# Altium schematic sheet PowerSupp.SchDoc
size A3; DocumentNumber: 4; SheetNumber: 4; SheetTotal: 7
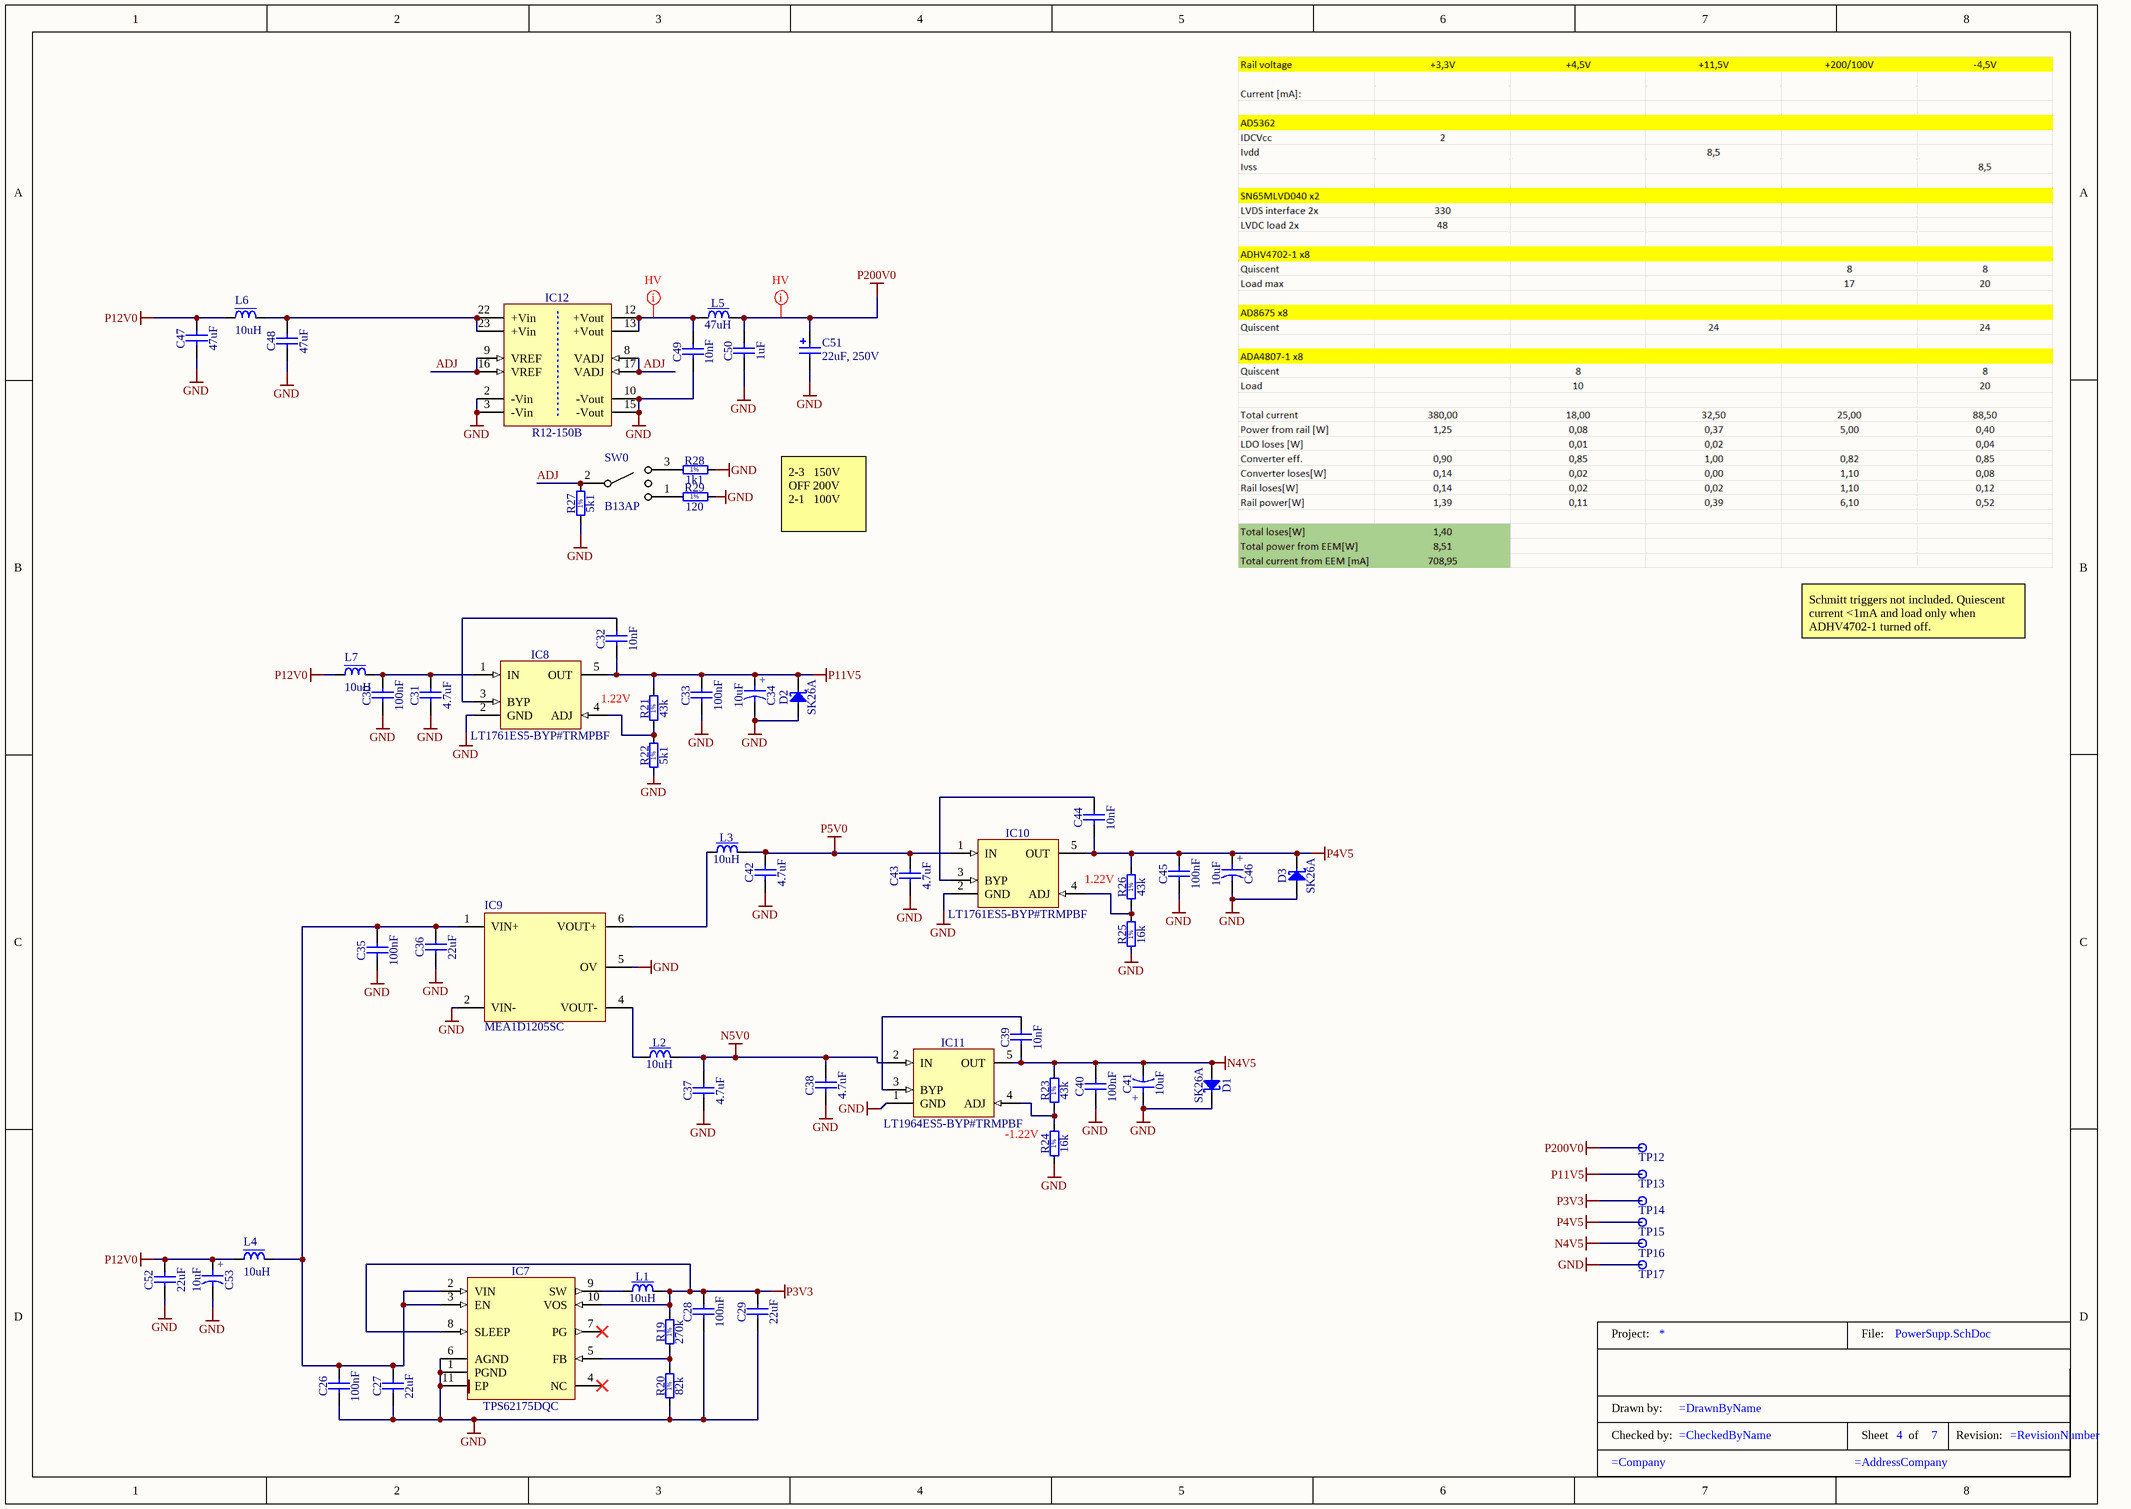
[diagram p0: PowerSupp.SchDoc]

## Parts
C26  100nF  [CAPC1005X55N]
C27  22uF  [CAPC2012X135N]
C28  100nF  [CAPC1005X55N]
C29  22uF  [CAPC2012X135N]
C30  100nF  [CAPC1005X55N]
C31  4.7uF  [CAPC2012X135N]
C32  10nF  [CAPC1608X87N]
C33  100nF  [CAPC1005X55N]
C34  10uF  [CAPMP3528X210N]
C35  100nF  [CAPC1005X55N]
C36  22uF  [CAPC2012X135N]
C37  4.7uF  [CAPC2012X135N]
C38  4.7uF  [CAPC2012X135N]
C39  10nF  [CAPC1608X87N]
C40  100nF  [CAPC1005X55N]
C41  10uF  [CAPMP3528X210N]
C42  4.7uF  [CAPC2012X135N]
C43  4.7uF  [CAPC2012X135N]
C44  10nF  [CAPC1608X87N]
C45  100nF  [CAPC1005X55N]
C46  10uF  [CAPMP3528X210N]
C47  47uF  [CAPC5750X200N]
C48  47uF  [CAPC5750X200N]
C49  10nF  [CAPC3216X88N]
C50  1uF  [CAPC5750X270N]
C51  22uF, 250V  [WCAP-AT1H_13x20]
C52  22uF  [CAPC2012X135N]
C53  10uF  [CAPMP3528X210N]
D1  SK26A  [DIOM5126X265N]
D2  SK26A  [DIOM5126X265N]
D3  SK26A  [DIOM5126X265N]
IC7  TPS62175DQC  [SON50P200X300X80-11N-R94X250]
IC8  LT1761ES5-BYP#TRMPBF  [SOT95P280X100-5N]
IC9  MEA1D1205SC  [MURA-SIP-5_V]
IC10  LT1761ES5-BYP#TRMPBF  [SOT95P280X100-5N]
IC11  LT1964ES5-BYP#TRMPBF  [SOT95P280X100-5N]
IC12  R12-150B  [DCDC_RECOM_Rxx-B]
L1  10uH  [IND_MURATA-PS_8400]
L2  10uH  [IND_MURATA-PS_8400]
L3  10uH  [IND_MURATA-PS_8400]
L4  10uH  [IND_MURATA-PS_8400]
L5  47uH  [IND_MURATA-PS_8400]
L6  10uH  [IND_MURATA-PS_8400]
L7  10uH  [IND_MURATA-PS_8400]
R19  270k  [RESC1608X55N]
R20  82k  [RESC1608X55N]
R21  43k  [RESC1608X55N]
R22  5k1  [RESC1608X55N]
R23  43k  [RESC1608X55N]
R24  16k  [RESC1608X55N]
R25  16k  [RESC1608X55N]
R26  43k  [RESC1608X55N]
R27  5k1  [RESC1608X55N]
R28  1k1  [RESC1608X55N]
R29  120  [RESC1608X55N]
SW0  B13AP  [B13AP]
TitleBlock4  TitleBlock  (value not drawn)  (graphical)
TP12  Test Point  [TPS127]  (value not drawn)
TP13  Test Point  [TPS127]  (value not drawn)
TP14  Test Point  [TPS127]  (value not drawn)
TP15  Test Point  [TPS127]  (value not drawn)
TP16  Test Point  [TPS127]  (value not drawn)
TP17  Test Point  [TPS127]  (value not drawn)

## Nets
GND: C26.1 C27.1 C28.1 C29.1 C30.1 C31.1 C33.1 C34.2 C35.1 C36.1 C37.1 C38.1 C40.1 C41.1 C42.1 C43.1 C45.1 C46.2 C47.1 C48.1 C49.1 C50.1 C51.1(N) C52.1 C53.2 D1.1(C) D2.2(A) D3.2(A) IC7.1(PGND) IC7.6(AGND) IC7.11(EP) IC8.2(GND) IC9.2(VIN-) IC9.5(OV) IC10.2(GND) IC11.1(GND) IC12.2(-Vin) IC12.3(-Vin) IC12.10(-Vout) IC12.15(-Vout) R20.1 R22.1 R24.1 R25.1 R27.1 R28.2 R29.2 TP17.1
N4V5: C39.1 C40.2 C41.2 D1.2(A) IC11.5(OUT) R23.2 TP16.1
N5V0: C37.2 C38.2 IC11.2(IN) L2.2
P3V3: C28.2 C29.2 IC7.8(SLEEP) IC7.10(VOS) L1.2 R19.2 TP14.1
P4V5: C44.1 C45.2 C46.1 D3.1(C) IC10.5(OUT) R26.2 TP15.1
P5V0: C42.2 C43.2 IC10.1(IN) L3.2
P11V5: C32.1 C33.2 C34.1 D2.1(C) IC8.5(OUT) R21.2 TP13.1
P12V0: C47.2 C52.2 C53.1 L4.1 L6.1 L7.1
P200V0: C50.2 C51.2(P) L5.2 TP12.1
ADJ: IC12.8(VADJ) IC12.9(VREF) IC12.16(VREF) IC12.17(VADJ) R27.2 SW0.2(C)
NetC26_2: C26.2 C27.2 C35.2 C36.2 IC7.2(VIN) IC7.3(EN) IC9.1(VIN+) L4.2
NetC30_2: C30.2 C31.2 IC8.1(IN) L7.2
NetC32_2: C32.2 IC8.3(BYP)
NetC39_2: C39.2 IC11.3(BYP)
NetC44_2: C44.2 IC10.3(BYP)
NetC48_2: C48.2 IC12.22(+Vin) IC12.23(+Vin) L6.2
NetC49_2: C49.2 IC12.12(+Vout) IC12.13(+Vout) L5.1
NetIC7_5: IC7.5(FB) R19.1 R20.2
NetIC7_9: IC7.9(SW) L1.1
NetIC8_4: IC8.4(ADJ) R21.1 R22.2
NetIC9_4: IC9.4(VOUT-) L2.1
NetIC9_6: IC9.6(VOUT+) L3.1
NetIC10_4: IC10.4(ADJ) R25.2 R26.1
NetIC11_4: IC11.4(ADJ) R23.1 R24.2
NetR28_1: R28.1 SW0.3(NC)
NetR29_1: R29.1 SW0.1(NO)

Not connected (* = marked no-connect by the designer): IC7 4(NC)* 7(PG)*

## Layout directives
net class HighVoltage: NetC49_2, P200V0

## Notes on the sheet
- 2-3   150V OFF 200V  2-1   100V
- Schmitt triggers not included. Quiescent current <1mA and load only when ADHV4702-1 turned off.
- 1.22V
- (near R24) -1.22V
- (in symbol CTE3528-21_10UF_16V_20%_PANASONIC_TQC) +
- (in symbol R0603_1K1_1%_0.1W_100PPM) 1%
- (in symbol R0603_5K1_1%_0.1W_100PPM) 1%
- (in symbol R0603_16K_1%_0.1W_100PPM) 1%
- (in symbol R0603_43K_1%_0.1W_100PPM) 1%
- (in symbol R0603_82K_1%_0.1W_100PPM) 1%
- (in symbol R0603_120R_1%_0.1W_100PPM) 1%
- (in symbol R0603_270K_1%_0.1W_100PPM) 1%
- (in symbol TitleBlock) Project:; File:; Drawn by:; Checked by:; Sheet; of; Revision:

## Library data of the parts
C26 C28 C30 C33 C35 C40 C45 = CC0402_100NF_16V_10%_X7R: Non-polarised capacitor; Part Description: SMD Multilayer Chip Ceramic Capacitor; Manufacturer: GENERIC; Manufacturer1 Part Number: GRM155R71C104KA88D; Voltage: 16V; TC: X7R; Tolerance: ±10%; Part Number: CC0402_100NF_16V_10%_X7R; Component Kind: Standard; Component Type: Standard; Pin Count: 2; Value: 100nF; Status: Not Recommended; Manufacturer Part Number: CC0402_100NF_16V_10%_X7R; Case: 0402; Mounted: Yes; Socket: No; SMD: Yes; Sense: No; Manufacturer1 Example: MURATA; Manufacturer1 ComponentHeight: 0.55mm; HelpURL: \\cern.ch\dfs\Applications\Altium\Datasheets\CC0402_X7R_MURATA_GRM.pdf; Author: CERN DEM JLC; CreateDate: 05.12.2013; LatestRevisionDate: 03.12.2007
C27 C29 C36 C52 = CC0805_22UF_16V_10%_X5R: Non-polarised capacitor; Part Description: SMD Multilayer Chip Ceramic Capacitor; Manufacturer: GENERIC; Manufacturer1 Part Number: C2012X5R1C226KT; Voltage: 16V; TC: X5R; Tolerance: ±10%; Part Number: CC0805_22UF_16V_10%_X5R; Component Kind: Standard; Component Type: Standard; Pin Count: 2; Value: 22uF; Status: Preferred; Manufacturer Part Number: CC0805_22UF_16V_10%_X5R; Case: 0805; Mounted: Yes; Socket: No; SMD: Yes; Sense: No; Manufacturer1 Example: TDK; Manufacturer1 ComponentHeight: 1.35mm; HelpURL: \\cern.ch\dfs\Applications\Altium\Datasheets\CC0805_X5R_TDK_C.pdf; Author: CERN DEM JLC; CreateDate: 25.10.2012; LatestRevisionDate: 25.10.2012
C31 C37 C38 C42 C43 = CC0805_4.7UF_16V_10%_X7R: Non-polarised capacitor; Part Description: SMD Multilayer Chip Ceramic Capacitor; Manufacturer: GENERIC; Manufacturer1 Part Number: EMK212B7475KG-T; Voltage: 16V; TC: X7R; Tolerance: ±10%; Part Number: CC0805_4.7UF_16V_10%_X7R; Component Kind: Standard; Component Type: Standard; Pin Count: 2; Value: 4.7uF; Status: Preferred; Manufacturer Part Number: CC0805_4.7UF_16V_10%_X7R; Case: 0805; Mounted: Yes; Socket: No; SMD: Yes; Sense: No; Manufacturer1 Example: TAIYO YUDEN; Manufacturer1 ComponentHeight: 1.35mm; HelpURL: \\cern.ch\dfs\Applications\Altium\Datasheets\CC0805_X7R_TAIYO-YUDEN_HIGH-VALUE.pdf; Author: CERN DEM JLC; CreateDate: 16.09.2014; LatestRevisionDate: 16.09.2014
C32 C39 C44 = CC0603_10NF_50V_10%_X7R: Non-polarised capacitor; Part Description: SMD Multilayer Chip Ceramic Capacitor; Manufacturer: GENERIC; Manufacturer1 Part Number: 223858615636; Voltage: 50V; TC: X7R; Tolerance: ±10%; Part Number: CC0603_10NF_50V_10%_X7R; Component Kind: Standard; Component Type: Standard; Pin Count: 2; Value: 10nF; Status: Preferred; Manufacturer Part Number: CC0603_10NF_50V_10%_X7R; Case: 0603; Mounted: Yes; Socket: No; SMD: Yes; Sense: No; Manufacturer1 Example: PHYCOMP; Manufacturer1 ComponentHeight: 0.87mm; HelpURL: \\cern.ch\dfs\Applications\Altium\Datasheets\CC0603_X7R_PHYCOMP.pdf; Author: CERN DEM JLC; CreateDate: 03.12.2007; LatestRevisionDate: 03.12.2007
C34 C41 C46 C53 = CTE3528-21_10UF_16V_20%_PANASONIC_TQC: Polarised capacitor; Part Description: ESR 0R1 Solid Tantalum Chip Capacitor; Manufacturer Part Number: 16TQC10M; Voltage: 16V; Tolerance: ±20%; Part Number: CTE3528-21_10UF_16V_20%_PANASONIC_TQC; Component Kind: Standard; Component Type: Standard; Pin Count: 2; Value: 10uF; Status: None; Manufacturer: PANASONIC; Case: B; Mounted: Yes; Socket: No; SMD: Yes; Sense: No; ComponentHeight: 2mm; HelpURL: \\cern.ch\dfs\Applications\Altium\Datasheets\CTE_PANASONIC_TQC.pdf; Author: CERN DEM JLC; CreateDate: 01.09.2014; LatestRevisionDate: 01.09.2014
C47 C48 = CC2220_47UF_16V_20%_X7R: Non-polarised capacitor; Part Description: Multilayer Ceramic Chip Capacitor; Manufacturer: GENERIC; Manufacturer1 Part Number: C5750X7R1C476M230KB; Voltage: 16V; TC: X7R; Tolerance: ±20%; Part Number: CC2220_47UF_16V_20%_X7R; Component Kind: Standard; Component Type: Standard; Pin Count: 2; Value: 47uF; Status: None; Manufacturer Part Number: CC2220_47UF_16V_20%_X7R; Case: 2220; Mounted: Yes; Socket: No; SMD: Yes; Sense: No; Manufacturer1 Example: TDK; Manufacturer1 ComponentHeight: 2.5mm; HelpURL: \\cern.ch\dfs\Applications\Altium\Datasheets\CC2220_X7R_TDK_C.pdf; Author: CERN DEM JLC; CreateDate: 31.01.2017; LatestRevisionDate: 31.01.2017
C49 = CC1206_10NF_250V_10%_X7R: Non-polarised capacitor; Part Description: SMD Multilayer Chip Ceramic Capacitor; Manufacturer: GENERIC; Manufacturer1 Part Number: C1206C103KARACTU; Voltage: 250V; TC: X7R; Tolerance: ±10%; Part Number: CC1206_10NF_250V_10%_X7R; Component Kind: Standard; Component Type: Standard; Pin Count: 2; Value: 10nF; Status: None; Manufacturer Part Number: CC1206_10NF_250V_10%_X7R; Case: 1206; Mounted: Yes; Socket: No; SMD: Yes; Sense: No; Manufacturer1 Example: KEMET; Manufacturer1 ComponentHeight: 0.88mm; HelpURL: \\cern.ch\dfs\Applications\Altium\Datasheets\CC1206_X7R_KEMET.pdf; Author: CERN DEM MR; CreateDate: 30.05.2018; LatestRevisionDate: 30.05.2018
C50 = CC2220_1UF_250V_10%_X7T_MURATA_GC355XD72E105KX05L: Non-polarised capacitor; Part Description: High Ripple Current Chip Monolithic Ceramic Capacitors for Automotive; Manufacturer: MURATA; Voltage: 250V; TC: X7T; Tolerance: ±10%; Part Number: CC2220_1UF_250V_10%_X7T_MURATA_GC355XD72E105KX05L; Component Kind: Standard; Component Type: Standard; Pin Count: 2; Value: 1uF; Status: None; Manufacturer Part Number: GC355XD72E105KX05L; Case: 2220; Mounted: Yes; Socket: No; SMD: Yes; Sense: No; ComponentHeight: 2.7mm; HelpURL: \\cern.ch\dfs\Applications\Altium\Datasheets\CC2220_MURATA_GC355XD72E105KX05L.pdf; Author: CERN DEM JLC; CreateDate: 09.05.2017; LatestRevisionDate: 09.05.2017
C51 = 860241178002: WCAP-AT1H Aluminum Electrolytic Capacitor, Radial, THT, D13xH20mm, 22uF, 250V; Manufacturer: Wurth Elektronik; Dissipation Factor: 15%; Endurance: 10000h; Leakage Current: 320uA; Ripple Current: 490mA; Capacitance Tolerance: +/-20%; Rated Voltage: 250VDC; Technical Reference: ATJI200220M250DSPACK000; ComponentLink1Description: Manufacturer; ComponentLink1URL: http://www.we-online.de; ComponentLink2Description: Datasheet; ComponentLink2URL: https://www.we-online.com/catalog/datasheet/860241178002.pdf; Height: 20mm; Mounting Technology: THT; Operating Temperature: -25 to +105degC; Packaging: Ammo Pack; Published Date: May 2020; Capacitance: 22uF; Diameter: 13mm; Manufacturer Part Number: 860241178002
D1-D3 = SK26A: Schottky Diode; Part Description: 2A, 60V Surface Mount Schottky Barrier Rectifier; Manufacturer: TAIWAN SEMICONDUCTOR; Voltage: 60V; Power: 2A; PressFit: No; Bonding: No; Part Number: SK26A; Component Kind: Standard; Component Type: Standard; Device: SK26A; PackageDescription: DO-214-AC/SMA Molded Diode, 2-Leads, Body 5.1x2.6mm, IPC Medium Density; Manufacturer Part Number: SK26A; Pin Count: 2; Case: DO-214AC; Mounted: Yes; Socket: No; SMD: Yes; Sense: No; ComponentHeight: 2.5mm; HelpURL: \\cern.ch\dfs\Applications\Altium\Datasheets\SK26A.pdf; Author: CERN DEM JMW; CreateDate: 07.08.2015; LatestRevisionDate: 07.08.2015
IC7 = TPS62175DQC: 4.75-28VDC to 1-6VDC, 500mA Step-Down Converter With Sleep Mode; Manufacturer: TEXAS INSTRUMENTS; PressFit: No; Bonding: No; Part Number: TPS62175DQC; Component Kind: Standard; Component Type: Standard; Device: TPS62175DQC; PackageDescription: SON, 10-Leads, Body 2x3mm, Pitch 0.5mm, Thermal Pad 0.94x2.5mm, IPC Medium Density; Part Description: 4.75-28VDC to 1-6VDC, 500mA Step-Down Converter With Sleep Mode; Manufacturer Part Number: TPS62175DQC; Pin Count: 11; Case: SON10; Mounted: Yes; Socket: No; SMD: Yes; Sense: No; ComponentHeight: 0.8mm; HelpURL: \\cern.ch\dfs\Applications\Altium\Datasheets\TPS62175DQC.pdf; Author: CERN DEM JMW; CreateDate: 11.08.2015; LatestRevisionDate: 11.08.2015
IC8 IC10 = LT1761ES5-BYP#TRMPBF: 100mA, Low Noise, LDO Micropower Adjustable Regulator in SOT-23; Part Description: 1.22V to 20V, 100mA, Low Noise, LDO Adjustable Micropower Regulator; Manufacturer: LINEAR TECHNOLOGY; PressFit: No; Bonding: No; Part Number: LT1761ES5-BYP#TRMPBF; Component Kind: Standard; Component Type: Standard; Device: LT1761ES5-BYP#TRMPBF; PackageDescription: SOT23, 0.95mm pitch; 5 pin, 1.6mm W X 2.9mm L, IPC Medium Density; Manufacturer Part Number: LT1761ES5-BYP#TRMPBF; Pin Count: 5; Case: SOT23; Mounted: Yes; Socket: No; SMD: Yes; Sense: No; ComponentHeight: 1mm; HelpURL: \\cern.ch\dfs\Applications\Altium\Datasheets\LT1761ES5-SD#TRMPBF.pdf; Author: CERN DEM MR; CreateDate: 17.02.2016; LatestRevisionDate: 17.02.2016
IC9 = MEA1D1205SC: Module DC-DC 2-OUT 5V/-5V 0.1A/-0.1A 1W 5-Pin SIP Tube; Manufacturer 1: Murata; Number of Outputs: 2; Max Input Voltage (DC): 13.2V; Min Input Voltage (DC): 10.8V; Nominal Output Voltage: -5V; Max Output Current: 100mA; Efficiency: 85%; Voltage - Output 1: 5V; Isolation Voltage: 1kV; Nominal Input Voltage: 12V; Isolation: Isolated; Supplier 1: Mouser; Manufacturer Part Number 1: MEA1D1205SC; Stock 1: 75; Pricing 1: 1=5,39000, 5=5,33000, 10=5,25000, 25=4,96000, 50=4,84000, 100=4,60000 (USD); RoHS: Yes; Mount: Through Hole; Case/Package: SIP; Number of Pins: 5; Min Operating Temperature: -40°C; Max Operating Temperature: 85°C; Output Power: 1W; Packaging: Rail/Tube; Package Quantity: 25; Max Power Dissipation: 1W; Max Input Voltage: 13.2V; Min Input Voltage: 10.8V; Voltage - Output 2: -5V; Output Current: 100mA; Output Voltage: 5V; Current - Output 1: 100mA; Current - Output 2: 100mA; Max Output Power: 1W; Length: 19.65mm; Height: 0.4inch; Depth: 6.15mm; Width: 0.24inch; Radiation Hardening: No; REACH SVHC: No SVHC; ComponentLink1URL: https://datasheet.ciiva.com/11837/0900766b80dc6287-11837761.pdf?src-supplier=RSComponents; ComponentLink1Description: https://datasheet.ciiva.com/11837/0900766b80dc6287-11837761.pdf?src-supplier=RSComponents; ComponentLink2URL: https://datasheet.ciiva.com/26329/158005-da-01-en-dc-dc-wandler-mea1d1205sc-mps-26329995.pdf?src-supplier=Conrad; ComponentLink2Description: https://datasheet.ciiva.com/26329/158005-da-01-en-dc-dc-wandler-mea1d1205sc-mps-26329995.pdf?src-supplier=Conrad; ComponentLink3URL: https://datasheet.ciiva.com/17329/kdc-mea-17329820.pdf?src-supplier=Avnet+Europe; ComponentLink3Description: https://datasheet.ciiva.com/17329/kdc-mea-17329820.pdf?src-supplier=Avnet+Europe; ComponentLink4URL: https://datasheet.ciiva.com/8218/kdc-mea-8218205.pdf?src-supplier=Avnet; ComponentLink4Description: https://datasheet.ciiva.com/8218/kdc-mea-8218205.pdf?src-supplier=Avnet; Supplier Part Number 1: 580-MEA1D1205SC
IC11 = LT1964ES5-BYP#TRMPBF: 200mA, Low Noise, Low Dropout Negative Micropower Regulator; Part Description: -1.22V to -20V, 200mA, Low Noise, Low Dropout Negative Micropower Regulator; Manufacturer: LINEAR TECHNOLOGY; PressFit: No; Bonding: No; Part Number: LT1964ES5-BYP#TRMPBF; Component Kind: Standard; Component Type: Standard; Device: LT1964ES5-BYP#TRMPBF; PackageDescription: SOT23, 0.95mm pitch; 5 pin, 1.75mm W X 3.00mm L, IPC Medium Density; Manufacturer Part Number: LT1964ES5-BYP#TRMPBF; Pin Count: 5; Case: SOT23-5; Mounted: Yes; Socket: No; SMD: Yes; Sense: No; ComponentHeight: 1mm; HelpURL: \\cern.ch\dfs\Applications\Altium\Datasheets\LT1964ES5-BYP#TRMPBF.pdf; Author: CERN DEM MR; CreateDate: 17.02.2016; LatestRevisionDate: 17.02.2016
IC12 = R12-150B: RECOM, Rxx-B Series, Single Output DCDC Converter; Part Description: 10-14VDC to 92-200VDC, 3kVDC Isolated, 5W DC-DC Converter; PressFit: No; Bonding: No; Part Number: R12-150B; Component Kind: Standard; Component Type: Standard; Device: R12-150B; PackageDescription: Rxx-B Series, Body 31.8x20.3mm, DIP24 Package; Manufacturer: RECOM; Manufacturer Part Number: R12-150B; Pin Count: 12; Mounted: Yes; Socket: No; SMD: No; Sense: No; ComponentHeight: 9.9mm; HelpURL: \\cern.ch\dfs\Applications\Altium\Datasheets\R12-150B.pdf; Author: CERN DEM MR; CreateDate: 29.08.2019; LatestRevisionDate: 29.08.2019
L1-L4 L6 L7 = IND_10UH_10%_MURATA-PS_8400: Inductor With Core; Part Description: Miniature Surface Mount Power Inductor (8400 Series); Manufacturer: MURATA POWER SOLUTIONS; Manufacturer Part Number: 84103C; Power: 950mA; Resistance: 0.24R; Tolerance: ±10%; Part Number: IND_10UH_10%_MURATA-PS_8400; Component Kind: Standard; Component Type: Standard; Pin Count: 2; Value: 10uH; Status: None; Mounted: Yes; Socket: No; SMD: Yes; Sense: No; ComponentHeight: 2.9mm; HelpURL: \\cern.ch\dfs\Applications\Altium\Datasheets\IND_MURATA-PS_8400.pdf; Author: CERN DEM JLC; CreateDate: 02.07.2012; LatestRevisionDate: 02.07.2012
L5 = IND_47UH_10%_MURATA-PS_8400: Inductor With Core; Part Description: Miniature Surface Mount Power Inductor (8400 Series); Manufacturer: MURATA POWER SOLUTIONS; Manufacturer Part Number: 84473C; Power: 420mA; Resistance: 1.1R; Tolerance: ±10%; Part Number: IND_47UH_10%_MURATA-PS_8400; Component Kind: Standard; Component Type: Standard; Pin Count: 2; Value: 47uH; Status: None; Mounted: Yes; Socket: No; SMD: Yes; Sense: No; ComponentHeight: 2.9mm; HelpURL: \\cern.ch\dfs\Applications\Altium\Datasheets\IND_MURATA-PS_8400.pdf; Author: CERN DEM JLC; CreateDate: 21.09.2011; LatestRevisionDate: 21.09.2011
R19 = R0603_270K_1%_0.1W_100PPM: Resistor - 1%; Part Description: General Purpose Thick Film Chip Resistor; Manufacturer: GENERIC; Manufacturer1 Part Number: NRC06F2703TRF; Power: 0.1W; TC: ±100ppm/°C; PressFit: No; Part Number: R0603_270K_1%_0.1W_100PPM; Component Kind: Standard; Component Type: Standard; Pin Count: 2; Value: 270k; Status: Preferred; Tolerance: ±1%; Manufacturer Part Number: R0603_270K_1%_0.1W_100PPM; Case: 0603; Mounted: Yes; Sense: No; Socket: No; SMD: Yes; Manufacturer1 Example: NIC COMPONENT; Manufacturer1 ComponentHeight: 0.55mm; HelpURL: \\cern.ch\dfs\Applications\Altium\Datasheets\R0603_NIC_NRC.pdf; Author: CERN DEM JLC; CreateDate: 03.12.2007; LatestRevisionDate: 13.03.2008
R20 = R0603_82K_1%_0.1W_100PPM: Resistor - 1%; Part Description: General Purpose Thick Film Chip Resistor; Manufacturer: GENERIC; Manufacturer1 Part Number: NRC06F8202TRF; Power: 0.1W; TC: ±100ppm/°C; PressFit: No; Part Number: R0603_82K_1%_0.1W_100PPM; Component Kind: Standard; Component Type: Standard; Pin Count: 2; Value: 82k; Status: Preferred; Tolerance: ±1%; Manufacturer Part Number: R0603_82K_1%_0.1W_100PPM; Case: 0603; Mounted: Yes; Sense: No; Socket: No; SMD: Yes; Manufacturer1 Example: NIC COMPONENT; Manufacturer1 ComponentHeight: 0.55mm; HelpURL: \\cern.ch\dfs\Applications\Altium\Datasheets\R0603_NIC_NRC.pdf; Author: CERN DEM JLC; CreateDate: 03.12.2007; LatestRevisionDate: 13.03.2008
R21 R23 R26 = R0603_43K_1%_0.1W_100PPM: Resistor - 1%; Part Description: General Purpose Thick Film Chip Resistor; Manufacturer: GENERIC; Manufacturer1 Part Number: NRC06F4302TRF; Power: 0.1W; TC: ±100ppm/°C; PressFit: No; Part Number: R0603_43K_1%_0.1W_100PPM; Component Kind: Standard; Component Type: Standard; Pin Count: 2; Value: 43k; Status: Preferred; Tolerance: ±1%; Manufacturer Part Number: R0603_43K_1%_0.1W_100PPM; Case: 0603; Mounted: Yes; Sense: No; Socket: No; SMD: Yes; Manufacturer1 Example: NIC COMPONENT; Manufacturer1 ComponentHeight: 0.55mm; HelpURL: \\cern.ch\dfs\Applications\Altium\Datasheets\R0603_NIC_NRC.pdf; Author: CERN DEM JLC; CreateDate: 03.12.2007; LatestRevisionDate: 13.03.2008
R22 R27 = R0603_5K1_1%_0.1W_100PPM: Resistor - 1%; Part Description: General Purpose Thick Film Chip Resistor; Manufacturer: GENERIC; Manufacturer1 Part Number: NRC06F5101TRF; Power: 0.1W; TC: ±100ppm/°C; PressFit: No; Part Number: R0603_5K1_1%_0.1W_100PPM; Component Kind: Standard; Component Type: Standard; Pin Count: 2; Value: 5k1; Status: Preferred; Tolerance: ±1%; Manufacturer Part Number: R0603_5K1_1%_0.1W_100PPM; Case: 0603; Mounted: Yes; Sense: No; Socket: No; SMD: Yes; Manufacturer1 Example: NIC COMPONENT; Manufacturer1 ComponentHeight: 0.55mm; HelpURL: \\cern.ch\dfs\Applications\Altium\Datasheets\R0603_NIC_NRC.pdf; Author: CERN DEM JLC; CreateDate: 03.12.2007; LatestRevisionDate: 13.03.2008
R24 R25 = R0603_16K_1%_0.1W_100PPM: Resistor - 1%; Part Description: General Purpose Thick Film Chip Resistor; Manufacturer: GENERIC; Manufacturer1 Part Number: NRC06F1602TRF; Power: 0.1W; TC: ±100ppm/°C; PressFit: No; Part Number: R0603_16K_1%_0.1W_100PPM; Component Kind: Standard; Component Type: Standard; Pin Count: 2; Value: 16k; Status: Preferred; Tolerance: ±1%; Manufacturer Part Number: R0603_16K_1%_0.1W_100PPM; Case: 0603; Mounted: Yes; Sense: No; Socket: No; SMD: Yes; Manufacturer1 Example: NIC COMPONENT; Manufacturer1 ComponentHeight: 0.55mm; HelpURL: \\cern.ch\dfs\Applications\Altium\Datasheets\R0603_NIC_NRC.pdf; Author: CERN DEM JLC; CreateDate: 03.12.2007; LatestRevisionDate: 13.03.2008
R28 = R0603_1K1_1%_0.1W_100PPM: Resistor - 1%; Part Description: General Purpose Thick Film Chip Resistor; Manufacturer: GENERIC; Manufacturer1 Part Number: NRC06F1101TRF; Power: 0.1W; TC: ±100ppm/°C; PressFit: No; Part Number: R0603_1K1_1%_0.1W_100PPM; Component Kind: Standard; Component Type: Standard; Pin Count: 2; Value: 1k1; Status: Preferred; Tolerance: ±1%; Manufacturer Part Number: R0603_1K1_1%_0.1W_100PPM; Case: 0603; Mounted: Yes; Sense: No; Socket: No; SMD: Yes; Manufacturer1 Example: NIC COMPONENT; Manufacturer1 ComponentHeight: 0.55mm; HelpURL: \\cern.ch\dfs\Applications\Altium\Datasheets\R0603_NIC_NRC.pdf; Author: CERN DEM JLC; CreateDate: 03.12.2007; LatestRevisionDate: 13.03.2008
R29 = R0603_120R_1%_0.1W_100PPM: Resistor - 1%; Part Description: General Purpose Thick Film Chip Resistor; Manufacturer: GENERIC; Manufacturer1 Part Number: NRC06F1200TRF; Power: 0.1W; TC: ±100ppm/°C; PressFit: No; Part Number: R0603_120R_1%_0.1W_100PPM; Component Kind: Standard; Component Type: Standard; Pin Count: 2; Value: 120; Status: Preferred; Tolerance: ±1%; Manufacturer Part Number: R0603_120R_1%_0.1W_100PPM; Case: 0603; Mounted: Yes; Sense: No; Socket: No; SMD: Yes; Manufacturer1 Example: NIC COMPONENT; Manufacturer1 ComponentHeight: 0.55mm; HelpURL: \\cern.ch\dfs\Applications\Altium\Datasheets\R0603_NIC_NRC.pdf; Author: CERN DEM JLC; CreateDate: 03.12.2007; LatestRevisionDate: 13.03.2008
SW0 = B13AP: Switch;  Sealed;  Anti-Static Toggle;  SPDT;  ON-OFF-ON;  Str PC;  No Cap;  0.4A;  28VAC/DC; Manufacturer 1: NKK Switches; Actuator Material: Brass; Voltage Rating (AC): 28V; Current Rating: 100mA; Power Rating: 400mW; Illumination Type: Non-Illuminated,Illuminated; Electrical Life: 50000Cycles; Actuator Type: Standard Round; Actuator Length: 10mm; Supplier 1: Digi-Key; Manufacturer Part Number 1: B13AP; Stock 1: 542; Pricing 1: 1=3,70000, 10=3,31100, 25=3,14160, 50=2,98760, 100=2,84900, 250=2,72580, 500=2,49480, 1000=2,37160 (USD); RoHS: Yes; Mount: Through Hole,PCB; Number of Pins: 1; Contact Plating: Gold; Contact Material: Bronze,Gold; Min Operating Temperature: -30°C; Max Operating Temperature: 85°C; Throw Configuration: SPDT; Packaging: Bulk; Voltage Rating (DC): 28V; Orientation: Vertical; Package Quantity: 1; Switch Function: On-Off-On; Termination: Solder; Max Current Rating: 100mA; Max Voltage Rating (AC): 28V; Max Voltage Rating (DC): 28V; Contact Current Rating: 100mA; Length: 8.8mm; Depth: 6.8mm; Lead Free: Lead Free; REACH SVHC: No SVHC; ComponentLink1URL: https://datasheet.ciiva.com/5287/btoggles-28447-5287190.pdf?src-supplier=Mouser; ComponentLink1Description: https://datasheet.ciiva.com/5287/btoggles-28447-5287190.pdf?src-supplier=Mouser; ComponentLink2URL: https://datasheet.ciiva.com/14542/70192333-14542216.pdf?src-supplier=Allied+Electronics; ComponentLink2Description: https://datasheet.ciiva.com/14542/70192333-14542216.pdf?src-supplier=Allied+Electronics; Supplier Part Number 1: 360-1013-ND
TP12-TP17 = SMD_PAD_1.27X1.27MM: Part Description: 1.27mm x 1.27mm PCB Copper Area (SMD Test Point); Mounted: No; Part Number: SMD_PAD_1.27X1.27MM; Component Kind: Standard (No BOM); Component Type: Standard (No BOM); Pin Count: 1; Family: Test Point; Socket: No; SMD: Yes; Sense: No; Status: None; ComponentHeight: 0mm; HelpURL: Undefined; Author: CERN DEM JLC; CreateDate: 12.01.2008; LatestRevisionDate: 12.01.2008; PackageDescription: 1.27mm x 1.27mm PCB Copper Area (SMD Test Point)